# Altium schematic sheet NTC.SchDoc
size A4; SheetNumber: 7; SheetTotal: 7
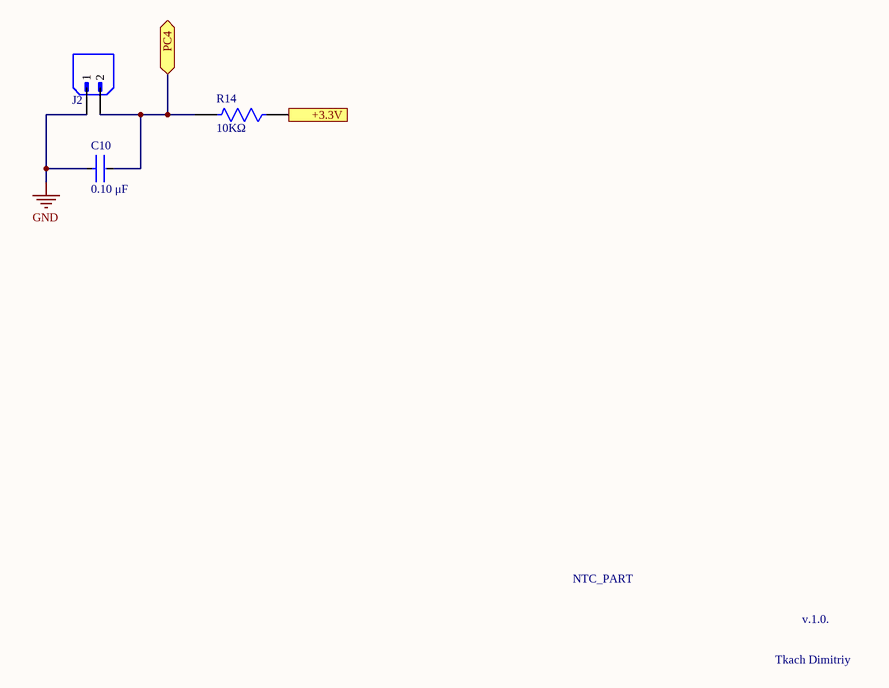
[diagram p0: NTC.SchDoc]

## Parts
C10  Capacitance: 0.10 μF  [CAPC3216X18M]  (hidden comment: C1206C104K5RACAUTO)
J2  B2B-XH-A  [JST_B2B-XH-A]  (value not drawn)
R14  Resistance: 10KΩ  [RESC3216X06M]  (hidden comment: CRGP1206F10K)

## Ports
+3.3V (in, see MainSheet[2B], Power[3B], STM8S103F3P6[3B], TM1637_Display[1B], UART[2B]), PC4 (bidir, see MainSheet[2B], STM8S103F3P6[2B])

## Nets
GND: C10.1 J2.1
+3.3V: R14.1 ; port +3.3V
PC4: C10.2 J2.2 R14.2 ; port PC4

## Notes on the sheet
- NTC_PART
- v.1.0.
- Tkach Dimitriy

## Library data of the parts
C10 = CMP-03020-005759-1: CAP CER 0.1UF 50V X7R 1206; Manufacturer: KEMET; Temperature Coefficient: 15%; Value: 0.10 μF; Material: Ceramic; Automotive Grade: Grade 0; Tolerance: 0.1; RoHS: TRUE; Lead Free: Yes; ComponentLink2Description: Datasheet; Automotive: Yes; Temperature Characteristic: X7R; Temperature Range Low: -55°C; Voltage Rating: 50 V; Device Class L1: Passive Components; Ipc Land Pattern Name: CAPC320160X78; Mouser Description: Multilayer Ceramic Capacitors MLCC - SMD/SMT 0.1uF 50volts 10% X7R AUTO; Octopart: https://octopart.com/c1206c104k5racauto-kemet-12595586; Device Class L3: Ceramic Capacitors; Manufacturer Part Number: C1206C104K5RACAUTO; Digikey Description: CAP CER 0.1UF 50V X7R 1206; Temperature Range High: +150°C; Temperature: -55°C to +150°C; Device Class L2: Capacitors; ComponentLink2URL: https://content.kemet.com/datasheets/KEM_C1007_X8R_ULTRA_150C_SMD.pdf; Package: C1206C-EB; Category: Cap; Height: 0.88mm
J2 = CMP-033-000000-1: MF: {'manufacturer': u'JST Sales America Inc.'}; Pin Count: 2; Source: B2B-XH-A.SchLib; Availability: Unavailable; Design Item ID: B2B-XH-A; Component Type: Standard; Value: *; Price: None; Package: None; MP: B2B-XH-A
R14 = CMP-03211-004788-1: CRGP 1206 10K 1%; Manufacturer: TE; Temperature Coefficient: ±100ppm/°C; Value: 10KΩ; Tolerance: 0.01; Power Rating: 0.5W; Voltage Rating: 200V; Package: CRGP1206; Ambient Temperature Range High: +70°C; Device Class L2: Resistors; Lead Free: Yes; Automotive: No; Series: CRGP; Temperature Range High: +155°C; Ipc Land Pattern Name: RESC310155X55; Device Class L1: Passive Components; Octopart: https://octopart.com/crgp1206f10k-te+connectivity-91018843; Temperature: -55°C to +155°C; Category: Res; Height: 0.65mm; Temperature Range Low: -55°C; RoHS: TRUE; Manufacturer Part Number: CRGP1206F10K; Digikey Description: CRGP 1206 10K 1%; Device Class L3: Chip SMD Resistors; Composition: Thick Film; ComponentLink2URL: https://www.mouser.com/datasheet/2/418/NG_DS_9-1773463-9_A-1358566.pdf; ComponentLink2Description: Datasheet